# Altium schematic sheet CC110L_868-915MHz_balun_external_ant.SchDoc
size A4
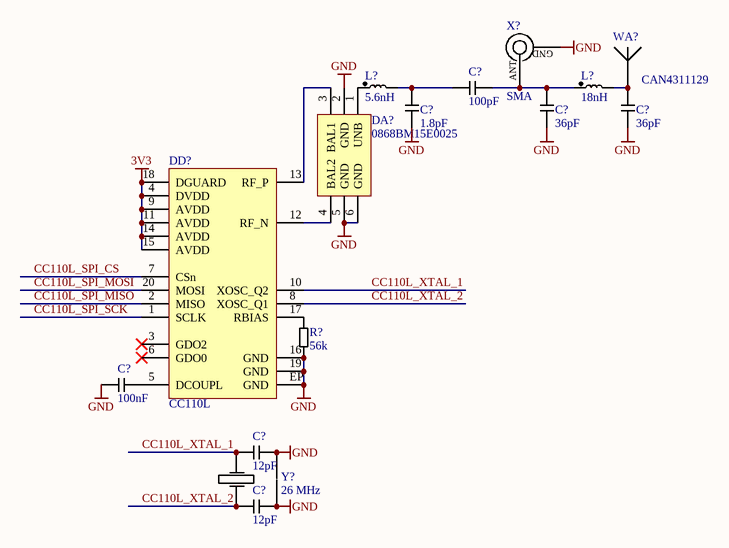
[diagram p0: CC110L_868-915MHz_balun_external_ant.SchDoc]

## Parts
(Parts that share a designator on the sheet are numbered #1, #2 ... from top to bottom, then left to right.)
C?#1  100pF  [C0603]
C?#2  1.8pF  [C0603]
C?#3  36pF  [C0603]
C?#4  36pF  [C0603]
C?#5  100nF  [C0603]
C?#6  12pF  [C0603]
C?#7  12pF  [C0603]
DA?  0868BM15E0025  [xxxxBM15yyyyy]
DD?  CC110L  [QFN-20]
L?#1  5.6nH  [L0603]
L?#2  18nH  [L0603]
R?  56k  [R0603]
WA?  CAN4311129  [CAN4311129090871K]
X?  SMA  [SMA]
Y?  26 MHz  [Xtal 0532]

## Nets
3V3: DD?.4(DVDD) DD?.9(AVDD) DD?.11(AVDD) DD?.14(AVDD) DD?.15(AVDD) DD?.18(DGUARD)
GND: C?#2.2 C?#3.2 C?#4.2 C?#5.1 C?#6.2 C?#7.2 DA?.2(GND) DA?.5(GND) DA?.6(GND) DD?.16(GND) DD?.19(GND) DD?.EP(GND) R?.1 X?.1 Y?.1(X1) Y?.3(X2)
CC110L_SPI_CS: DD?.7(CSn)
CC110L_SPI_MISO: DD?.2(MISO)
CC110L_SPI_MOSI: DD?.20(MOSI)
CC110L_SPI_SCK: DD?.1(SCLK)
CC110L_XTAL_1: C?#6.1 DD?.10(XOSC_Q2) Y?.4(GND)
CC110L_XTAL_2: C?#7.1 DD?.8(XOSC_Q1) Y?.2(GND)
NetC?#1_1: C?#1.1 C?#2.1 L?#1.2
NetC?#1_2: C?#1.2 C?#3.1 L?#2.1 X?.2
NetC?#4_1: C?#4.1 L?#2.2 WA?.1(ANT)
NetC?#5_2: C?#5.2 DD?.5(DCOUPL)
NetDA?_1: DA?.1(UNB) L?#1.1
NetDA?_3: DA?.3(BAL1) DD?.13(RF_P)
NetDA?_4: DA?.4(BAL2) DD?.12(RF_N)
NetDD?_17: DD?.17(RBIAS) R?.2

Not connected (* = marked no-connect by the designer): DD? 3(GDO2)* 6(GDO0)*

## Notes on the sheet
- (in symbol SMA) GND; ANT

## Library data of the parts
C?#1-C?#7 = C: Capacitor
DA? = xxxxBM15E0025: Balun for CC11xx Johanson Technology; DigiKey: http://www.digikey.com/short/3pj8pb
DD? = CC110L: Value Line Transceiver
L?#1 L?#2 = L: Inductor
R? = R: Resistor
WA? = 868 MHz ANT
X? = SMA: SMA slot
Y? = Xtal: Quartz crystal